# EAGLE design loadcellamplifier1 (EAGLE 5.11)
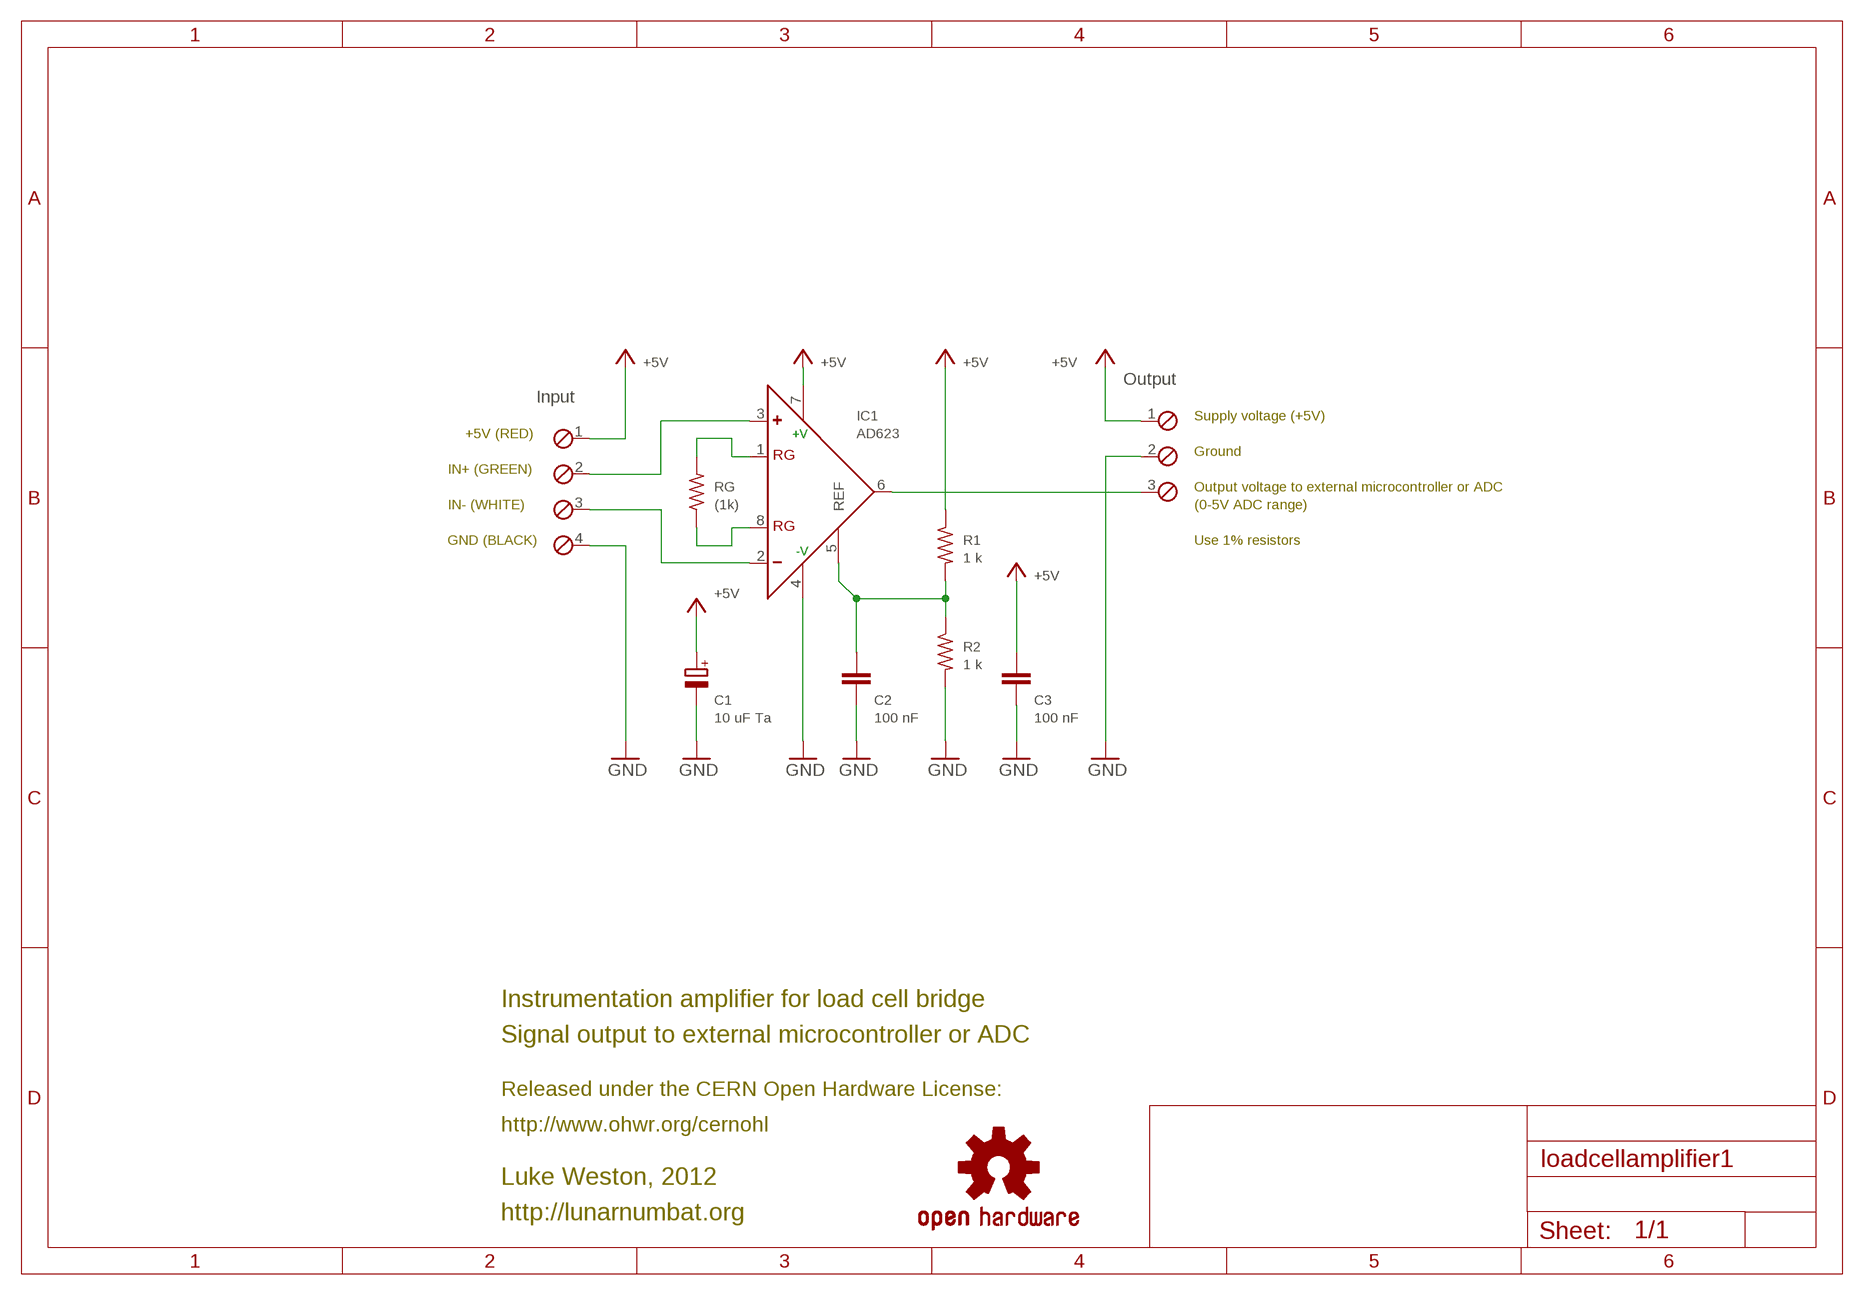
[diagram p0: schematic, sheet 1]

## Parts
C1  10 uF Ta  CPOL-EUE2.5-5  [E2,5-5]
C2  100 nF  C-EU025-024X044  [C025-024X044]
C3  100 nF  C-EU025-024X044  [C025-024X044]
IC1  AD623  AD623N  [DIL08]
R1  1 k  R-US_0207/10  [0207/10]
R2  1 k  R-US_0207/10  [0207/10]
RG  (1k)  R-US_0207/10  [0207/10]
U$2  OSHW-LOGOS  [OSHW-LOGO-S]
X1  Output  MPT3  [3POL254]
X2  Input  MPT4  [4POL254]

## Nets
+5V: C1.+ C3.1 IC1.7(+V) R1.1 X1.1 X2.1
GND: C1.- C2.2 C3.2 IC1.4(-V) R2.2 X1.2 X2.4
N$7: IC1.8(RG) RG.1
N$8: IC1.1(RG) RG.2
N$14: IC1.3(+) X2.2
N$15: IC1.2(-) X2.3
N$16: IC1.6(OUT) X1.3
N$24: C2.1 IC1.5(REF) R1.2 R2.1

## Notes on the sheet
- Supply voltage (+5V)
- +5V (RED)
- Ground
- IN+ (GREEN)
- Output voltage to external microcontroller or ADC
- IN- (WHITE) | (0-5V ADC range)
- GND (BLACK) | Use 1% resistors
- Instrumentation amplifier for load cell bridge
- Signal output to external microcontroller or ADC
- Released under the CERN Open Hardware License:
- http://www.ohwr.org/cernohl
- Luke Weston, 2012
- http://lunarnumbat.org

## Library data of the parts
C1 = rcl:CPOL-EU: POLARIZED CAPACITOR, European symbol
C2 C3 = rcl:C-EU: CAPACITOR, European symbol
IC1 = analog-devices:AD623: Single-Supply, Rail-to-Rail, Low Cost Instrumentation Amplifier Source: http://www.analog.com/static/imported-files/data_sheets/AD623.pdf; MF: ALTERA CORPORATION; MPN: AD623ANZ; OC_FARNELL: 9603700; OC_NEWARK: 59K4402
R1 R2 RG = rcl:R-US_: RESISTOR, American symbol
U$2 = SparkFun:OSHW-LOGO: Open Source Hardware Logo This logo indicates the piece of hardware it is found on incorporates a OSHW license and/or adheres to the definition of open source hardware found here: http://freedomdefined.org/OSHW
X1 = con-phoenix-254:MPT3: PHOENIX CONNECTOR; OC_FARNELL: unknown; OC_NEWARK: unknown
X2 = con-phoenix-254:MPT4: PHOENIX CONNECTOR; OC_FARNELL: unknown; OC_NEWARK: unknown

## Board
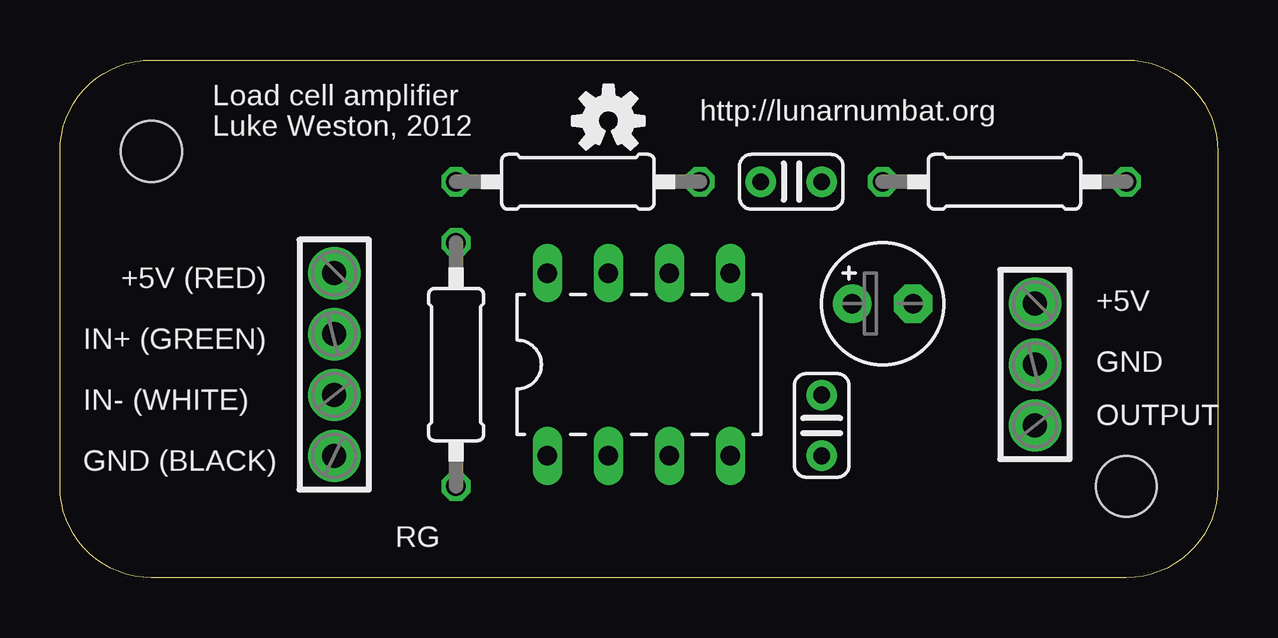
[diagram p1: board, top side]
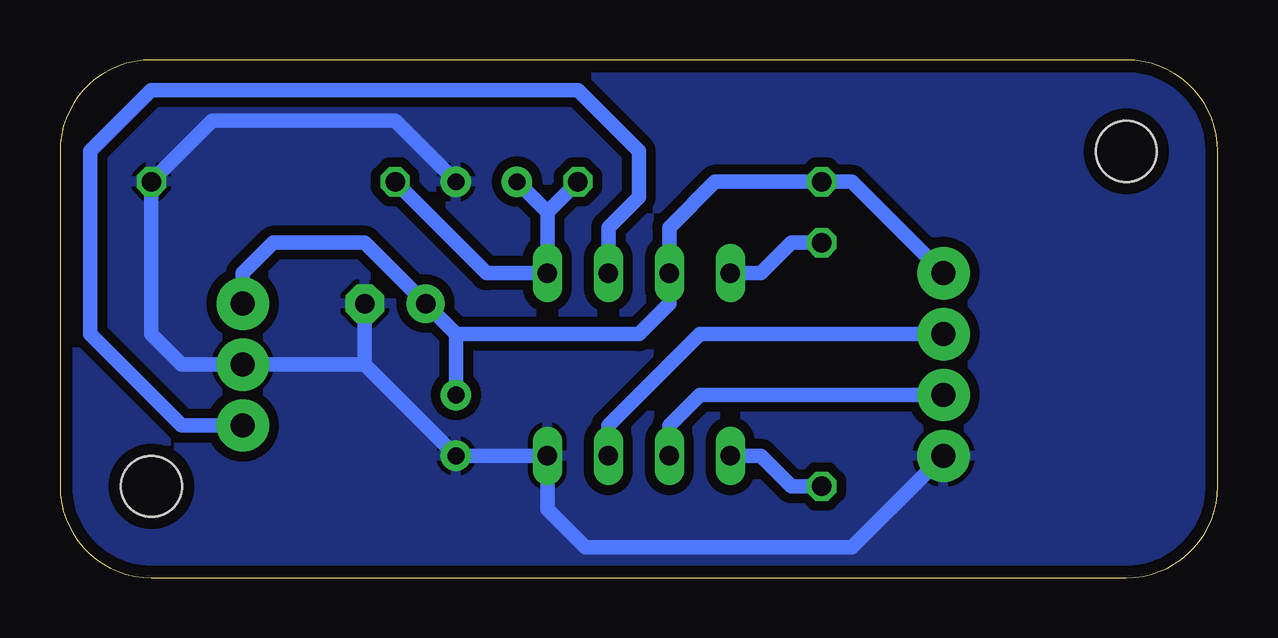
[diagram p2: board, bottom side, seen from below]

Size 48.26 x 21.59 mm. Coordinates in mm from the lower left corner, seen from the top.
Outline: 0,17.78 arc-90 3.81,21.59 44.45,21.59 arc-90 48.26,17.78 48.26,3.81 arc-90 44.45,0 3.81,0 arc-90 0,3.81 0,17.78
Copper layers (1*16): Top 0.035mm / dielectric 1.5mm / Bottom 0.035mm
Design rules "PCBCart-Standard": minimum track width 8mil, minimum drill 0.4mm, track to track 8mil, track to pad 8mil, pad to pad 8mil, via to via 8mil, smd to smd 8mil, copper to edge 20mil, drill to drill 8mil, minimum pad ring 8mil, minimum via ring 10mil, stop-mask expansion 3mil, vias tented up to drill 0mil, thermal gap 8mil
Holes 2.54 mm at 3.81,17.78 44.45,3.81

### Footprints (pad centres in the part's own frame; a part is rotated, then mirrored left to right if it is on the bottom)
E2,5-5 = drill 0.813 pad 1.6 round: + -1.27,0 | drill 0.813 pad 1.6 octagon: - 1.27,0
C025-024X044 = drill 0.7 pad 1.27 round: 1 -1.27,0; 2 1.27,0
DIL08 = drill 0.813 long: 1 -3.81,-3.81; 2 -1.27,-3.81; 3 1.27,-3.81; 4 3.81,-3.81; 5 3.81,3.81; 6 1.27,3.81; 7 -1.27,3.81; 8 -3.81,3.81
0207/10 = drill 0.813 octagon: 1 -5.08,0; 2 5.08,0
3POL254 = drill 1 pad 2.184 round: 1 -2.54,0; 2 0,0; 3 2.54,0
4POL254 = drill 1 pad 2.184 round: 1 -3.81,0; 2 -1.27,0; 3 1.27,0; 4 3.81,0

### Placement (x,y rotation side)
C1  34.29,11.43 0 top
C2  30.48,16.51 0 top
C3  31.75,6.35 270 top
IC1  24.13,8.89 0 top
R1  21.59,16.51 0 top
R2  39.37,16.51 0 top
RG  16.51,8.89 270 top
U$2  22.86,19.05 0 top
X1  40.64,8.89 270 top
X2  11.43,8.89 270 top

### Tracks (layer width: path | path; a pad name or v marks a point on that pad's centre or on a via)
+5V
  Bottom 0.61: X2.1 15.24,16.51 R1.1 20.96,16.51 22.86,14.61 IC1.7 22.86,11.43 24.13,10.16 31.75,10.16 | 31.75,10.16 C1.+ 35.56,13.97 39.37,13.97 40.64,12.7 X1.1 | 31.75,10.16 C3.1
GND
  Bottom 0.61: X2.4 15.24,1.27 26.35,1.27 27.94,2.86 IC1.4 C3.2 35.56,8.89 | 35.56,8.89 X1.2 43.18,8.89 44.45,10.16 R2.2 41.91,19.05 34.29,19.05 C2.2 | 35.56,8.89 C1.-
  pour Bottom (isolate 0.406): -1.27,22.86 49.53,22.86 49.53,-1.27 -1.27,-1.27
N$7
  Bottom 0.61: RG.1 17.78,13.97 19.05,12.7 IC1.8
N$8
  Bottom 0.61: RG.2 17.78,3.81 19.05,5.08 IC1.1
N$14
  Bottom 0.61: X2.2 21.59,10.16 25.4,6.35 IC1.3
N$15
  Bottom 0.61: X2.3 21.59,7.62 22.86,6.35 IC1.2
N$16
  Bottom 0.61: IC1.6 25.4,14.61 24.13,15.88 24.13,17.78 26.67,20.32 44.45,20.32 46.99,17.78 46.99,10.16 43.18,6.35 X1.3
N$24
  Bottom 0.61: 27.94,15.24 IC1.5 30.48,12.7 R2.1 | 27.94,15.24 R1.2 | 27.94,15.24 C2.1

### Text on the board
tPlace: Load cell amplifier | Luke Weston, 2012 | http://lunarnumbat.org | +5V (RED) | +5V | IN+ (GREEN) | GND | IN- (WHITE) | OUTPUT | GND (BLACK) | RG